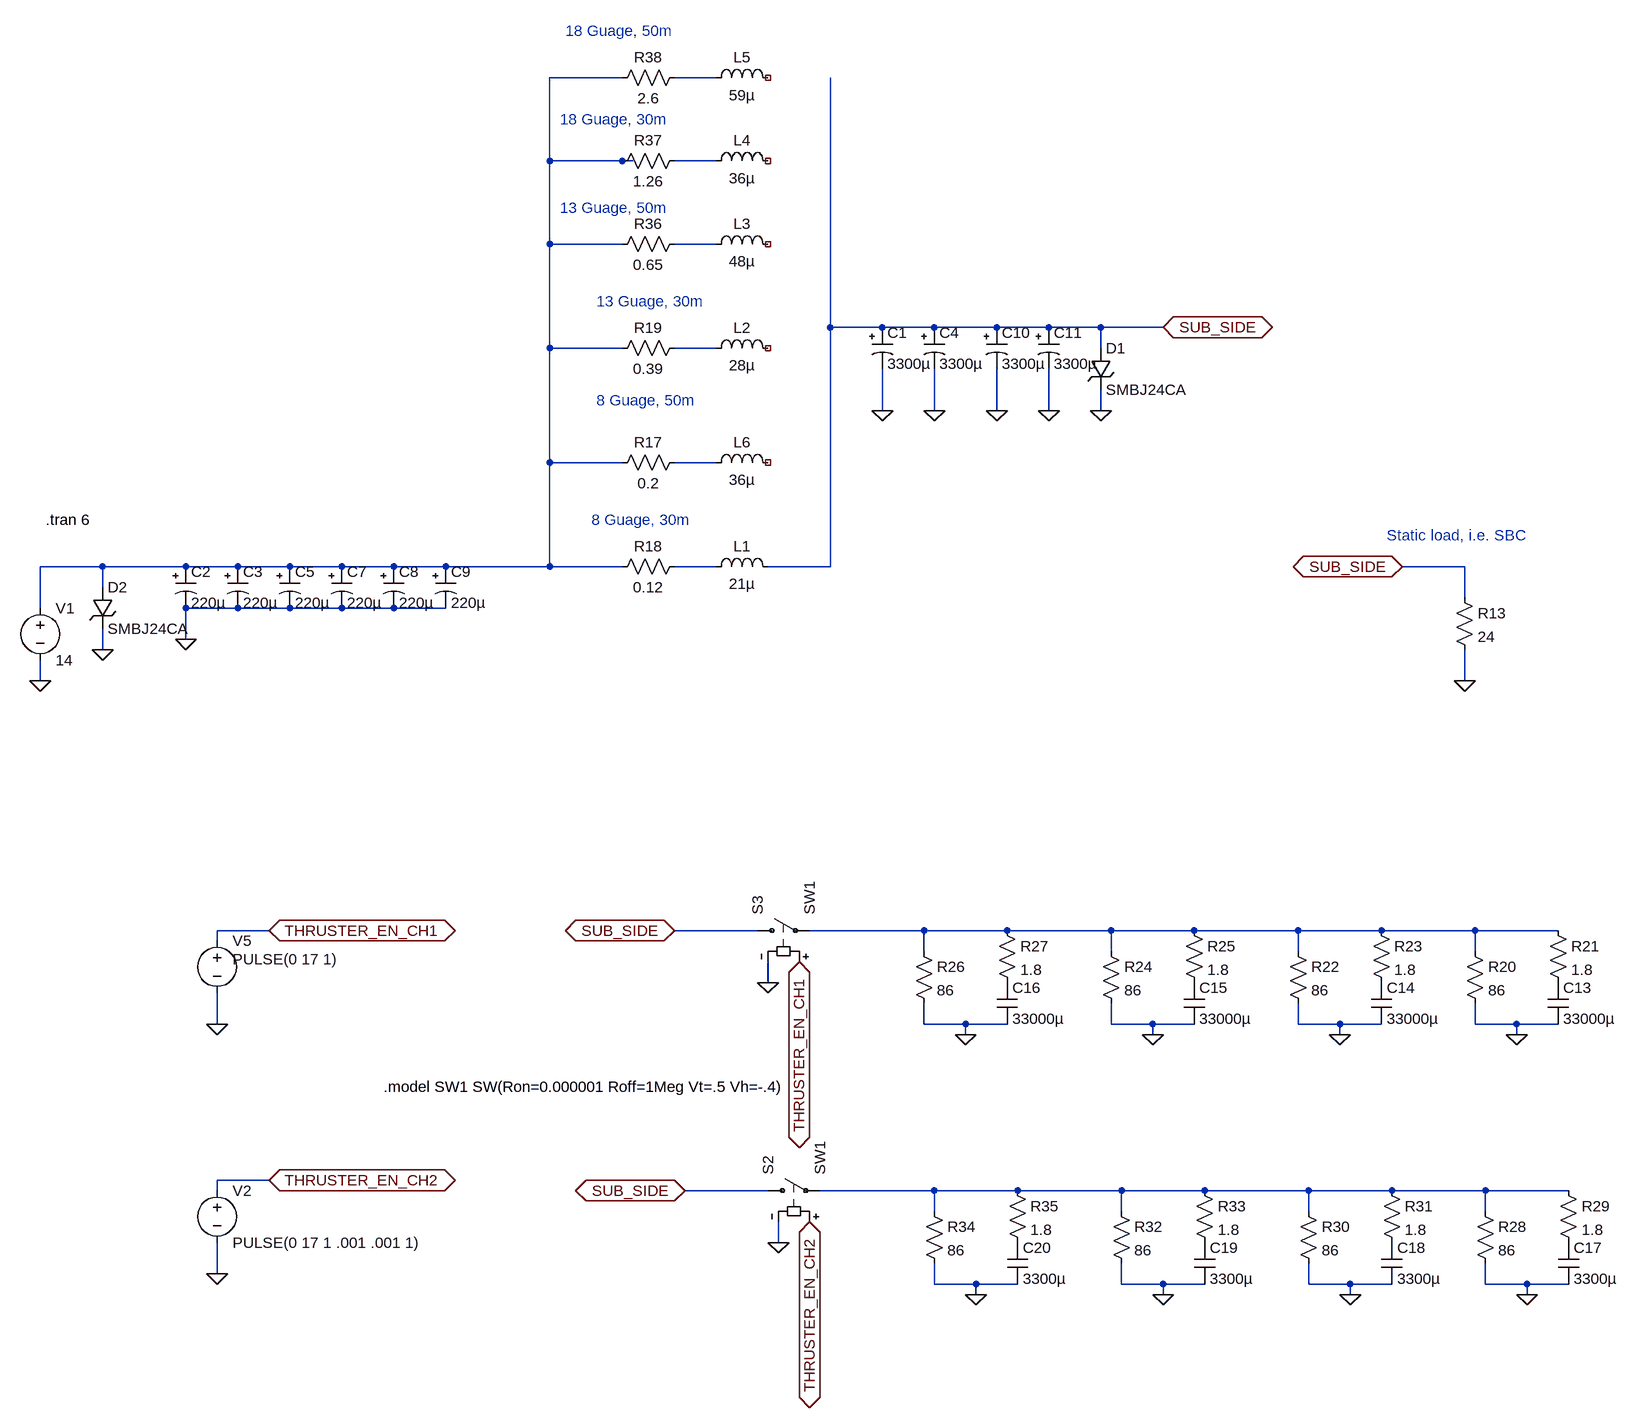
[diagram p0: schematic tether_analysis.asc]
tether_analysis.asc, the LTspice schematic file:
Version 4
SHEET 1 3096 680
WIRE 1552 -3296 1440 -3296
WIRE 1696 -3296 1632 -3296
WIRE 1440 -3168 1440 -3296
WIRE 1552 -3168 1440 -3168
WIRE 1568 -3168 1552 -3168
WIRE 1696 -3168 1632 -3168
WIRE 1440 -3040 1440 -3168
WIRE 1552 -3040 1440 -3040
WIRE 1696 -3040 1632 -3040
WIRE 1872 -2912 1872 -3296
WIRE 1952 -2912 1872 -2912
WIRE 2032 -2912 1952 -2912
WIRE 2128 -2912 2032 -2912
WIRE 2208 -2912 2128 -2912
WIRE 2288 -2912 2208 -2912
WIRE 2384 -2912 2288 -2912
WIRE 1440 -2880 1440 -3040
WIRE 1552 -2880 1440 -2880
WIRE 1696 -2880 1632 -2880
WIRE 2288 -2880 2288 -2912
WIRE 1952 -2784 1952 -2848
WIRE 2032 -2784 2032 -2848
WIRE 2128 -2784 2128 -2848
WIRE 2208 -2784 2208 -2848
WIRE 2288 -2784 2288 -2816
WIRE 1440 -2704 1440 -2880
WIRE 1552 -2704 1440 -2704
WIRE 1696 -2704 1632 -2704
WIRE 752 -2544 656 -2544
WIRE 880 -2544 752 -2544
WIRE 960 -2544 880 -2544
WIRE 1040 -2544 960 -2544
WIRE 1120 -2544 1040 -2544
WIRE 1200 -2544 1120 -2544
WIRE 1280 -2544 1200 -2544
WIRE 1440 -2544 1440 -2704
WIRE 1440 -2544 1280 -2544
WIRE 1552 -2544 1440 -2544
WIRE 1696 -2544 1632 -2544
WIRE 1872 -2544 1872 -2912
WIRE 1872 -2544 1776 -2544
WIRE 2848 -2544 2752 -2544
WIRE 752 -2512 752 -2544
WIRE 2848 -2496 2848 -2544
WIRE 656 -2480 656 -2544
WIRE 960 -2480 880 -2480
WIRE 1040 -2480 960 -2480
WIRE 1120 -2480 1040 -2480
WIRE 1200 -2480 1120 -2480
WIRE 1280 -2480 1200 -2480
WIRE 880 -2432 880 -2480
WIRE 752 -2416 752 -2448
WIRE 656 -2368 656 -2400
WIRE 2848 -2368 2848 -2416
WIRE 1008 -1984 928 -1984
WIRE 1760 -1984 1632 -1984
WIRE 2016 -1984 1840 -1984
WIRE 2144 -1984 2016 -1984
WIRE 2304 -1984 2144 -1984
WIRE 2432 -1984 2304 -1984
WIRE 2592 -1984 2432 -1984
WIRE 2720 -1984 2592 -1984
WIRE 2864 -1984 2720 -1984
WIRE 2992 -1984 2864 -1984
WIRE 928 -1968 928 -1984
WIRE 2016 -1952 2016 -1984
WIRE 2304 -1952 2304 -1984
WIRE 2592 -1952 2592 -1984
WIRE 2864 -1952 2864 -1984
WIRE 1776 -1904 1776 -1936
WIRE 928 -1840 928 -1888
WIRE 2016 -1840 2016 -1872
WIRE 2080 -1840 2016 -1840
WIRE 2144 -1840 2080 -1840
WIRE 2304 -1840 2304 -1872
WIRE 2368 -1840 2304 -1840
WIRE 2432 -1840 2368 -1840
WIRE 2592 -1840 2592 -1872
WIRE 2656 -1840 2592 -1840
WIRE 2720 -1840 2656 -1840
WIRE 2864 -1840 2864 -1872
WIRE 2928 -1840 2864 -1840
WIRE 2992 -1840 2928 -1840
WIRE 2080 -1824 2080 -1840
WIRE 2368 -1824 2368 -1840
WIRE 2656 -1824 2656 -1840
WIRE 2928 -1824 2928 -1840
WIRE 1008 -1600 928 -1600
WIRE 928 -1584 928 -1600
WIRE 1776 -1584 1648 -1584
WIRE 2032 -1584 1856 -1584
WIRE 2160 -1584 2032 -1584
WIRE 2320 -1584 2160 -1584
WIRE 2448 -1584 2320 -1584
WIRE 2608 -1584 2448 -1584
WIRE 2736 -1584 2608 -1584
WIRE 2880 -1584 2736 -1584
WIRE 3008 -1584 2880 -1584
WIRE 2032 -1552 2032 -1584
WIRE 2320 -1552 2320 -1584
WIRE 2608 -1552 2608 -1584
WIRE 2880 -1552 2880 -1584
WIRE 1792 -1504 1792 -1536
WIRE 928 -1456 928 -1504
WIRE 2032 -1440 2032 -1472
WIRE 2096 -1440 2032 -1440
WIRE 2160 -1440 2096 -1440
WIRE 2320 -1440 2320 -1472
WIRE 2384 -1440 2320 -1440
WIRE 2448 -1440 2384 -1440
WIRE 2608 -1440 2608 -1472
WIRE 2672 -1440 2608 -1440
WIRE 2736 -1440 2672 -1440
WIRE 2880 -1440 2880 -1472
WIRE 2944 -1440 2880 -1440
WIRE 3008 -1440 2944 -1440
WIRE 2096 -1424 2096 -1440
WIRE 2384 -1424 2384 -1440
WIRE 2672 -1424 2672 -1440
WIRE 2944 -1424 2944 -1440
FLAG 656 -2368 0
FLAG 880 -2432 0
FLAG 2128 -2784 0
FLAG 2848 -2368 0
FLAG 1008 -1984 THRUSTER_EN_CH1
IOPIN 1008 -1984 BiDir
FLAG 928 -1840 0
FLAG 2384 -2912 SUB_SIDE
IOPIN 2384 -2912 BiDir
FLAG 2288 -2784 0
FLAG 752 -2416 0
FLAG 2928 -1824 0
FLAG 2656 -1824 0
FLAG 2368 -1824 0
FLAG 2080 -1824 0
FLAG 1632 -1984 SUB_SIDE
IOPIN 1632 -1984 BiDir
FLAG 1776 -1904 0
FLAG 1824 -1936 THRUSTER_EN_CH1
IOPIN 1824 -1936 BiDir
FLAG 2944 -1424 0
FLAG 2672 -1424 0
FLAG 2384 -1424 0
FLAG 2096 -1424 0
FLAG 1648 -1584 SUB_SIDE
IOPIN 1648 -1584 BiDir
FLAG 1792 -1504 0
FLAG 1840 -1536 THRUSTER_EN_CH2
IOPIN 1840 -1536 BiDir
FLAG 2752 -2544 SUB_SIDE
IOPIN 2752 -2544 BiDir
FLAG 2208 -2784 0
FLAG 1008 -1600 THRUSTER_EN_CH2
IOPIN 1008 -1600 BiDir
FLAG 928 -1456 0
FLAG 1952 -2784 0
FLAG 2032 -2784 0
SYMBOL voltage 656 -2496 R0
WINDOW 123 0 0 Left 2
WINDOW 39 0 0 Left 2
SYMATTR InstName V1
SYMATTR Value 14
SYMBOL res 2832 -2512 R0
SYMATTR InstName R13
SYMATTR Value 24
SYMBOL voltage 928 -1984 R0
WINDOW 123 0 0 Left 2
WINDOW 39 0 0 Left 2
WINDOW 3 24 44 Left 2
SYMATTR Value PULSE(0 17 1)
SYMATTR InstName V5
SYMBOL polcap 864 -2544 R0
WINDOW 3 24 56 Left 2
SYMATTR Value 220µ
SYMATTR InstName C2
SYMATTR Description Capacitor
SYMATTR Type cap
SYMATTR SpiceLine V=35 Irms=770m Rser=0.09 Lser=0 mfg="Nichicon" pn="UPL1V221MPH6" type="Al electrolytic"
SYMBOL polcap 944 -2544 R0
WINDOW 3 24 56 Left 2
SYMATTR Value 220µ
SYMATTR InstName C3
SYMATTR Description Capacitor
SYMATTR Type cap
SYMATTR SpiceLine V=35 Irms=770m Rser=0.09 Lser=0 mfg="Nichicon" pn="UPL1V221MPH6" type="Al electrolytic"
SYMBOL polcap 1024 -2544 R0
WINDOW 3 24 56 Left 2
SYMATTR Value 220µ
SYMATTR InstName C5
SYMATTR Description Capacitor
SYMATTR Type cap
SYMATTR SpiceLine V=35 Irms=770m Rser=0.09 Lser=0 mfg="Nichicon" pn="UPL1V221MPH6" type="Al electrolytic"
SYMBOL polcap 1104 -2544 R0
WINDOW 3 24 56 Left 2
SYMATTR Value 220µ
SYMATTR InstName C7
SYMATTR Description Capacitor
SYMATTR Type cap
SYMATTR SpiceLine V=35 Irms=770m Rser=0.09 Lser=0 mfg="Nichicon" pn="UPL1V221MPH6" type="Al electrolytic"
SYMBOL polcap 1184 -2544 R0
WINDOW 3 24 56 Left 2
SYMATTR Value 220µ
SYMATTR InstName C8
SYMATTR Description Capacitor
SYMATTR Type cap
SYMATTR SpiceLine V=35 Irms=770m Rser=0.09 Lser=0 mfg="Nichicon" pn="UPL1V221MPH6" type="Al electrolytic"
SYMBOL polcap 1264 -2544 R0
WINDOW 3 24 56 Left 2
SYMATTR Value 220µ
SYMATTR InstName C9
SYMATTR Description Capacitor
SYMATTR Type cap
SYMATTR SpiceLine V=35 Irms=770m Rser=0.09 Lser=0 mfg="Nichicon" pn="UPL1V221MPH6" type="Al electrolytic"
SYMBOL res 1648 -2560 R90
WINDOW 0 0 56 VBottom 2
WINDOW 3 32 56 VTop 2
SYMATTR InstName R18
SYMATTR Value 0.12
SYMBOL polcap 2112 -2912 R0
WINDOW 3 24 56 Left 2
SYMATTR Value 3300µ
SYMATTR InstName C10
SYMATTR Description Capacitor
SYMATTR Type cap
SYMATTR SpiceLine V=35 Irms=770m Rser=0.09 Lser=0
SYMBOL polcap 2192 -2912 R0
WINDOW 3 24 56 Left 2
SYMATTR Value 3300µ
SYMATTR InstName C11
SYMATTR Description Capacitor
SYMATTR Type cap
SYMATTR SpiceLine V=35 Irms=770m Rser=0.09 Lser=0
SYMBOL ind 1680 -2528 R270
WINDOW 0 32 56 VTop 2
WINDOW 3 5 56 VBottom 2
SYMATTR InstName L1
SYMATTR Value 21µ
SYMBOL TVSdiode 2272 -2880 R0
SYMATTR InstName D1
SYMATTR Value SMBJ24CA
SYMBOL TVSdiode 736 -2512 R0
SYMATTR InstName D2
SYMATTR Value SMBJ24CA
SYMBOL res 2848 -1968 R0
SYMATTR InstName R20
SYMATTR Value 86
SYMBOL res 2976 -2000 R0
SYMATTR InstName R21
SYMATTR Value 1.8
SYMBOL cap 2976 -1904 R0
SYMATTR InstName C13
SYMATTR Value 33000µ
SYMBOL res 2576 -1968 R0
SYMATTR InstName R22
SYMATTR Value 86
SYMBOL res 2704 -2000 R0
SYMATTR InstName R23
SYMATTR Value 1.8
SYMBOL cap 2704 -1904 R0
SYMATTR InstName C14
SYMATTR Value 33000µ
SYMBOL res 2288 -1968 R0
SYMATTR InstName R24
SYMATTR Value 86
SYMBOL res 2416 -2000 R0
SYMATTR InstName R25
SYMATTR Value 1.8
SYMBOL cap 2416 -1904 R0
SYMATTR InstName C15
SYMATTR Value 33000µ
SYMBOL res 2000 -1968 R0
SYMATTR InstName R26
SYMATTR Value 86
SYMBOL res 2128 -2000 R0
SYMATTR InstName R27
SYMATTR Value 1.8
SYMBOL cap 2128 -1904 R0
SYMATTR InstName C16
SYMATTR Value 33000µ
SYMBOL sw 1744 -1984 R270
SYMATTR InstName S3
SYMATTR Value SW1
SYMBOL res 2864 -1568 R0
SYMATTR InstName R28
SYMATTR Value 86
SYMBOL res 2992 -1600 R0
SYMATTR InstName R29
SYMATTR Value 1.8
SYMBOL cap 2992 -1504 R0
SYMATTR InstName C17
SYMATTR Value 3300µ
SYMBOL res 2592 -1568 R0
SYMATTR InstName R30
SYMATTR Value 86
SYMBOL res 2720 -1600 R0
SYMATTR InstName R31
SYMATTR Value 1.8
SYMBOL cap 2720 -1504 R0
SYMATTR InstName C18
SYMATTR Value 3300µ
SYMBOL res 2304 -1568 R0
SYMATTR InstName R32
SYMATTR Value 86
SYMBOL res 2432 -1600 R0
SYMATTR InstName R33
SYMATTR Value 1.8
SYMBOL cap 2432 -1504 R0
SYMATTR InstName C19
SYMATTR Value 3300µ
SYMBOL res 2016 -1568 R0
SYMATTR InstName R34
SYMATTR Value 86
SYMBOL res 2144 -1600 R0
SYMATTR InstName R35
SYMATTR Value 1.8
SYMBOL cap 2144 -1504 R0
SYMATTR InstName C20
SYMATTR Value 3300µ
SYMBOL sw 1760 -1584 R270
SYMATTR InstName S2
SYMATTR Value SW1
SYMBOL res 1648 -2720 R90
WINDOW 0 0 56 VBottom 2
WINDOW 3 32 56 VTop 2
SYMATTR InstName R17
SYMATTR Value 0.2
SYMBOL res 1648 -2896 R90
WINDOW 0 0 56 VBottom 2
WINDOW 3 32 56 VTop 2
SYMATTR InstName R19
SYMATTR Value 0.39
SYMBOL res 1648 -3056 R90
WINDOW 0 0 56 VBottom 2
WINDOW 3 32 56 VTop 2
SYMATTR InstName R36
SYMATTR Value 0.65
SYMBOL res 1648 -3184 R90
WINDOW 0 0 56 VBottom 2
WINDOW 3 32 56 VTop 2
SYMATTR InstName R37
SYMATTR Value 1.26
SYMBOL res 1648 -3312 R90
WINDOW 0 0 56 VBottom 2
WINDOW 3 32 56 VTop 2
SYMATTR InstName R38
SYMATTR Value 2.6
SYMBOL ind 1680 -2864 R270
WINDOW 0 32 56 VTop 2
WINDOW 3 5 56 VBottom 2
SYMATTR InstName L2
SYMATTR Value 28µ
SYMBOL ind 1680 -3024 R270
WINDOW 0 32 56 VTop 2
WINDOW 3 5 56 VBottom 2
SYMATTR InstName L3
SYMATTR Value 48µ
SYMBOL ind 1680 -3152 R270
WINDOW 0 32 56 VTop 2
WINDOW 3 5 56 VBottom 2
SYMATTR InstName L4
SYMATTR Value 36µ
SYMBOL ind 1680 -3280 R270
WINDOW 0 32 56 VTop 2
WINDOW 3 5 56 VBottom 2
SYMATTR InstName L5
SYMATTR Value 59µ
SYMBOL ind 1680 -2688 R270
WINDOW 0 32 56 VTop 2
WINDOW 3 5 56 VBottom 2
SYMATTR InstName L6
SYMATTR Value 36µ
SYMBOL voltage 928 -1600 R0
WINDOW 123 0 0 Left 2
WINDOW 39 0 0 Left 2
SYMATTR InstName V2
SYMATTR Value PULSE(0 17 1 .001 .001 1)
SYMBOL polcap 1936 -2912 R0
WINDOW 3 24 56 Left 2
SYMATTR Value 3300µ
SYMATTR InstName C1
SYMATTR Description Capacitor
SYMATTR Type cap
SYMATTR SpiceLine V=35 Irms=770m Rser=0.09 Lser=0
SYMBOL polcap 2016 -2912 R0
WINDOW 3 24 56 Left 2
SYMATTR Value 3300µ
SYMATTR InstName C4
SYMATTR Description Capacitor
SYMATTR Type cap
SYMATTR SpiceLine V=35 Irms=770m Rser=0.09 Lser=0
TEXT 664 -2616 Left 2 !.tran 6
TEXT 1504 -2616 Left 2 ;8 Guage, 30m
TEXT 1184 -1744 Left 2 !.model SW1 SW(Ron=0.000001 Roff=1Meg Vt=.5 Vh=-.4)
TEXT 1512 -2800 Left 2 ;8 Guage, 50m
TEXT 1512 -2952 Left 2 ;13 Guage, 30m
TEXT 1456 -3096 Left 2 ;13 Guage, 50m
TEXT 1456 -3232 Left 2 ;18 Guage, 30m
TEXT 1464 -3368 Left 2 ;18 Guage, 50m
TEXT 2728 -2592 Left 2 ;Static load, i.e. SBC

The netlist it stands for:
* tether_analysis.asc
V1 N001 0 14
R13 SUB_SIDE 0 24
V5 THRUSTER_EN_CH1 0 PULSE(0 17 1)
C2 N001 0 220µ V=35 Irms=770m Rser=0.09 Lser=0 mfg="Nichicon" pn="UPL1V221MPH6" type="Al electrolytic"
C3 N001 0 220µ V=35 Irms=770m Rser=0.09 Lser=0 mfg="Nichicon" pn="UPL1V221MPH6" type="Al electrolytic"
C5 N001 0 220µ V=35 Irms=770m Rser=0.09 Lser=0 mfg="Nichicon" pn="UPL1V221MPH6" type="Al electrolytic"
C7 N001 0 220µ V=35 Irms=770m Rser=0.09 Lser=0 mfg="Nichicon" pn="UPL1V221MPH6" type="Al electrolytic"
C8 N001 0 220µ V=35 Irms=770m Rser=0.09 Lser=0 mfg="Nichicon" pn="UPL1V221MPH6" type="Al electrolytic"
C9 N001 0 220µ V=35 Irms=770m Rser=0.09 Lser=0 mfg="Nichicon" pn="UPL1V221MPH6" type="Al electrolytic"
R18 N007 N001 0.12
C10 SUB_SIDE 0 3300µ V=35 Irms=770m Rser=0.09 Lser=0
C11 SUB_SIDE 0 3300µ V=35 Irms=770m Rser=0.09 Lser=0
L1 N007 SUB_SIDE 21µ
D1 SUB_SIDE 0 SMBJ24CA
D2 N001 0 SMBJ24CA
R20 N008 0 86
R21 N008 P001 1.8
C13 P001 0 33000µ
R22 N008 0 86
R23 N008 P002 1.8
C14 P002 0 33000µ
R24 N008 0 86
R25 N008 P003 1.8
C15 P003 0 33000µ
R26 N008 0 86
R27 N008 P004 1.8
C16 P004 0 33000µ
S3 SUB_SIDE N008 THRUSTER_EN_CH1 0 SW1
R28 N009 0 86
R29 N009 P005 1.8
C17 P005 0 3300µ
R30 N009 0 86
R31 N009 P006 1.8
C18 P006 0 3300µ
R32 N009 0 86
R33 N009 P007 1.8
C19 P007 0 3300µ
R34 N009 0 86
R35 N009 P008 1.8
C20 P008 0 3300µ
S2 SUB_SIDE N009 THRUSTER_EN_CH2 0 SW1
R17 N006 N001 0.2
R19 N005 N001 0.39
R36 N004 N001 0.65
R37 N003 N001 1.26
R38 N002 N001 2.6
L2 N005 NC_01 28µ
L3 N004 NC_02 48µ
L4 N003 NC_03 36µ
L5 N002 NC_04 59µ
L6 N006 NC_05 36µ
V2 THRUSTER_EN_CH2 0 PULSE(0 17 1 .001 .001 1)
C1 SUB_SIDE 0 3300µ V=35 Irms=770m Rser=0.09 Lser=0
C4 SUB_SIDE 0 3300µ V=35 Irms=770m Rser=0.09 Lser=0
.model D D
.lib standard.dio
.tran 6
* 8 Guage, 30m
.model SW1 SW(Ron=0.000001 Roff=1Meg Vt=.5 Vh=-.4)
* 8 Guage, 50m
* 13 Guage, 30m
* 13 Guage, 50m
* 18 Guage, 30m
* 18 Guage, 50m
* Static load, i.e. SBC
.backanno
.end